# Altium schematic sheet SBH_Charger_Connectors.SchDoc: SBH_Charger_Connectors
size B; Date: 01/15/2023; Author: Electric Squad; Organization: ORGANIZATION; Address1: ADDRESS 1; Address2: ADDRESS 2; Address3: ADDRESS 3; Address4: ADDRESS 4; Revision: -; SheetNumber: 1; SheetTotal: 5; ENG_APP_DATE: --/--/--; DSN_APP_DATE: --/--/--; CHK_APP_DATE: --/--/--
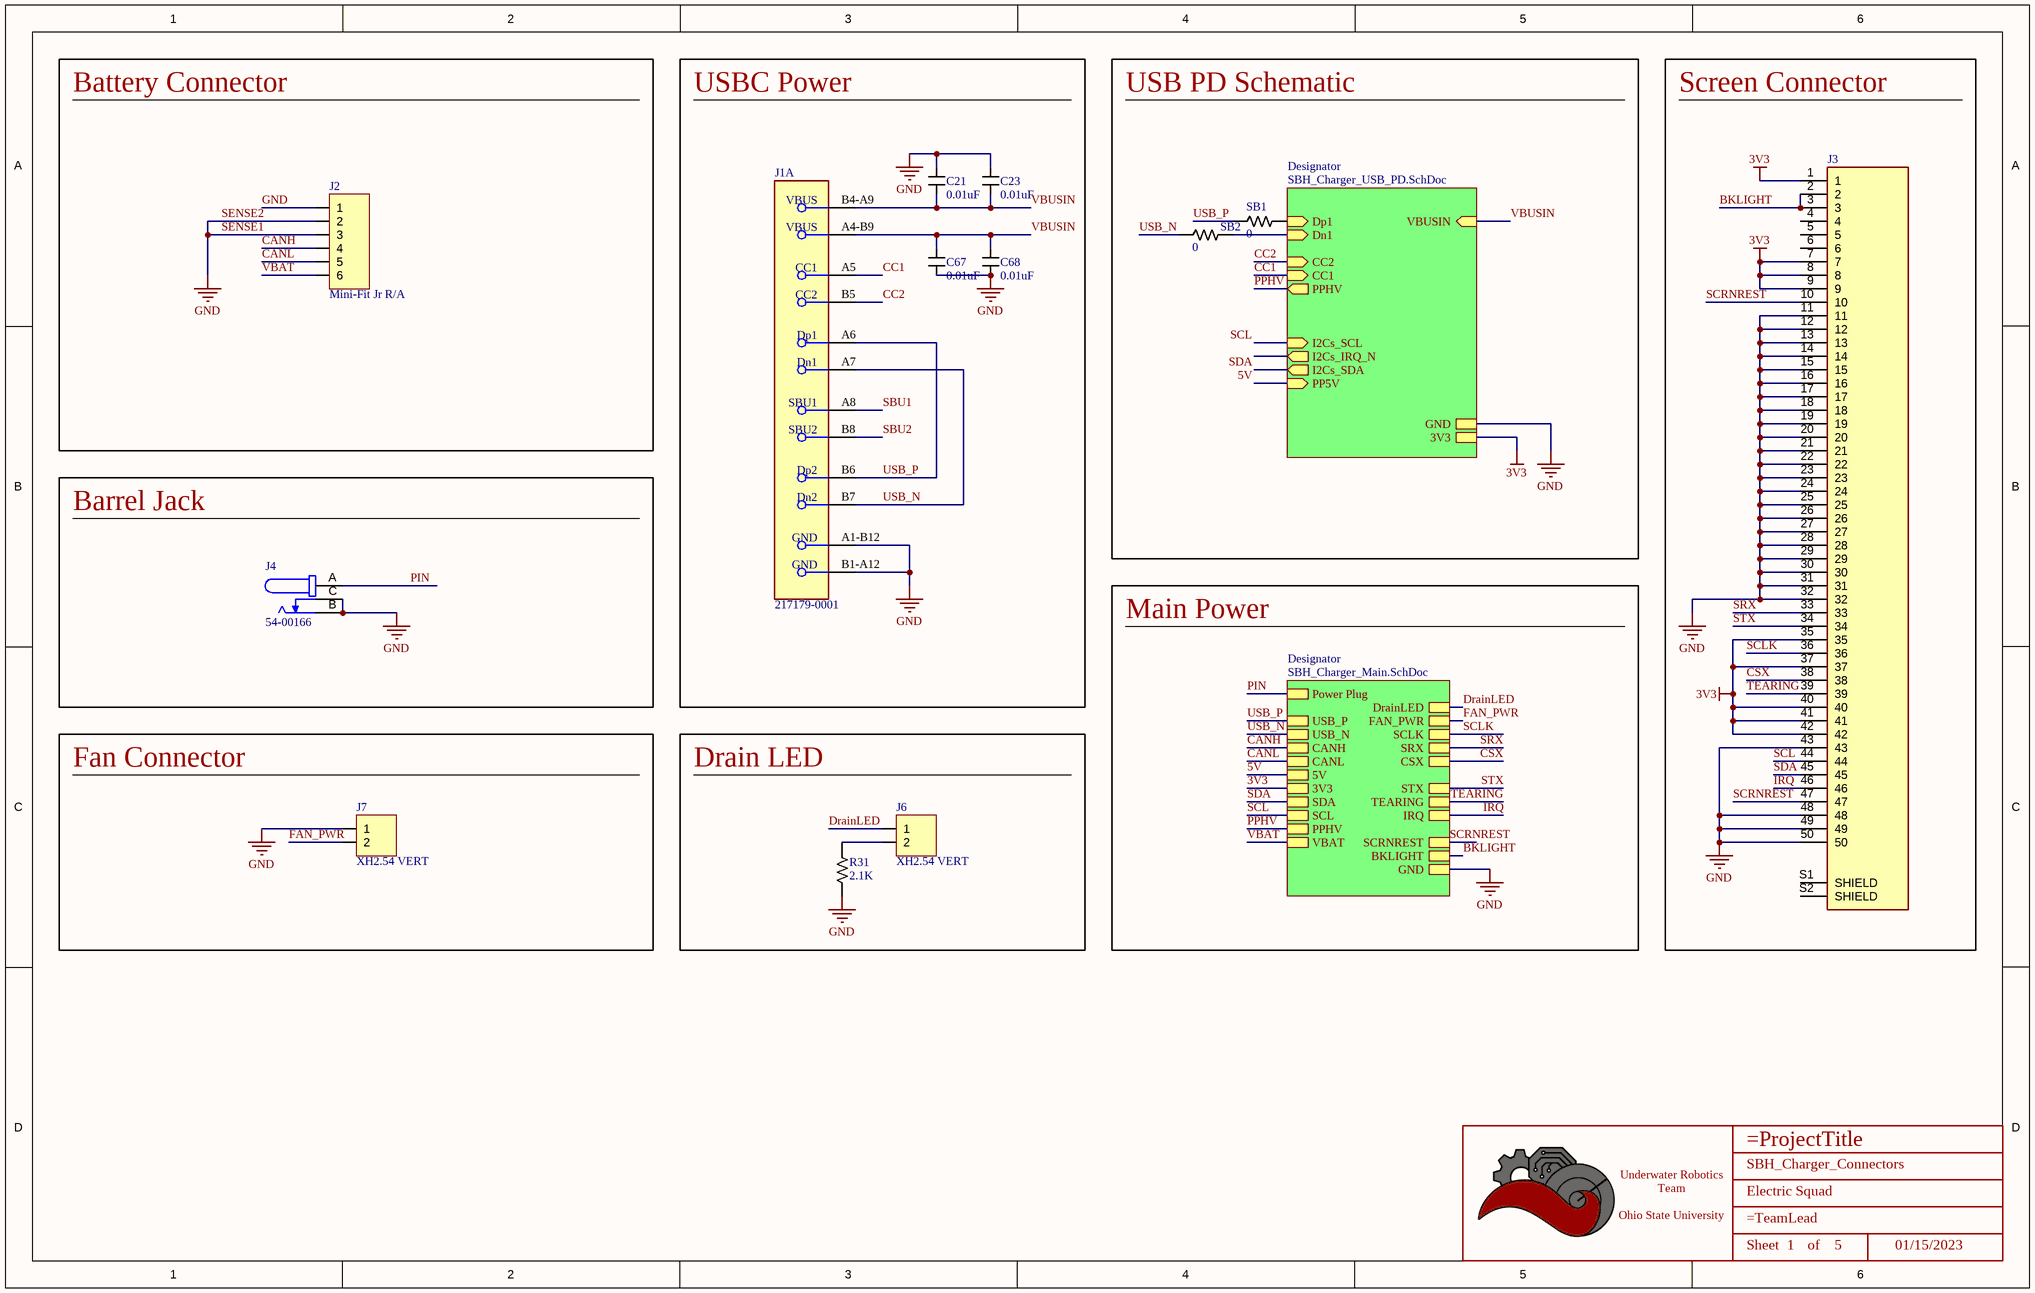
[diagram p0: SBH_Charger_Connectors.SchDoc]

## Parts
*  Title_Block  [LOGO]  (value not drawn)  (graphical)
C21  value 0.01uF  [CAPACITOR_0603]  (hidden comment: CL10B103KB8NNNC)
C23  value 0.01uF  [CAPACITOR_0603]  (hidden comment: CL10B103KB8NNNC)
C67  value 0.01uF  [CAPACITOR_0603]  (hidden comment: CL10B103KB8NNNC)
C68  value 0.01uF  [CAPACITOR_0603]  (hidden comment: CL10B103KB8NNNC)
J1  217179-0001  [CONN_USBC_FP-217179-0001-MFG]  (part A of 2)
J2  Mini-Fit Jr R/A  [CONN_MOLEX_MINIFIT JR_6 POS_R/A]
J3  FFC_50POS_0.5MM_HORIZ_TOP  [EASTRISING_ER-CON50HT-1]  (value not drawn)
J4  54-00166  [TENSILITY_54-00166]
J6  XH2.54 VERT  [CONN_JST_XH254_2POS_VERT]
J7  XH2.54 VERT  [CONN_JST_XH254_2POS_VERT]
R31  Value  (Ohms): 2.1K  [RESISTOR_0603]  (hidden comment: 2.1k Ohm 5% 1/8W)
SB1  Value  (Ohms): 0  [RESISTOR_0603]  (hidden comment: 0 Ohm Jumper No Fit)
SB2  Value  (Ohms): 0  [RESISTOR_0603]  (hidden comment: 0 Ohm Jumper No Fit)

## Blocks framed on the sheet
Battery Connector: J2
USBC Power: C21 C23 C67 C68 J1
USB PD Schematic: SB1 SB2
Barrel Jack: J4
Fan Connector: J7
Drain LED: J6 R31

## Sub-sheets
Designator = SBH_Charger_USB_PD.SchDoc: Dp1 (in), Dn1 (in), CC2 (in), CC1 (in), PPHV (out), I2Cs_SCL (in), I2Cs_IRQ_N (out), I2Cs_SDA (out), PP5V (in), GND, 3V3, VBUSIN (in)
Designator = SBH_Charger_Main.SchDoc: Power Plug, GND, USB_P, USB_N, CANH, CANL, 5V, 3V3, SDA, VBAT, PPHV, FAN_PWR, SCL, DrainLED, BKLIGHT, SCRNREST, SRX, CSX, STX, TEARING, IRQ, SCLK

## Nets
3V3: J3.1 J3.7 J3.8 J3.9 J3.35 J3.37 J3.40 J3.41 J3.42 ; sheet Designator/3V3, sheet Designator/3V3
GND: C21.1 C23.1 C67.2 C68.2 J1.A1-B12(GND) J1.B1-A12(GND) J2.1 J2.2 J2.3 J3.11 J3.12 J3.13 J3.14 J3.15 J3.16 J3.17 J3.18 J3.19 J3.20 J3.21 J3.22 J3.23 J3.24 J3.25 J3.26 J3.27 J3.28 J3.29 J3.30 J3.31 J3.32 J3.43 J3.48 J3.49 J3.50 J4.B J4.C J7.1 R31.2 ; sheet Designator/GND, sheet Designator/GND  [also labelled SENSE1, SENSE2]
5V: sheet Designator/PP5V, sheet Designator/5V
BKLIGHT: J3.2 J3.3 ; sheet Designator/BKLIGHT
CANH: J2.4 ; sheet Designator/CANH
CANL: J2.5 ; sheet Designator/CANL
CC1: J1.A5(CC1) ; sheet Designator/CC1
CC2: J1.B5(CC2) ; sheet Designator/CC2
CSX: J3.38 ; sheet Designator/CSX
DrainLED: J6.1 ; sheet Designator/DrainLED
FAN_PWR: J7.2 ; sheet Designator/FAN_PWR
IRQ: J3.46 ; sheet Designator/IRQ
PIN: J4.A ; sheet Designator/Power Plug
PPHV: sheet Designator/PPHV, sheet Designator/PPHV
SBU1: J1.A8(SBU1)
SBU2: J1.B8(SBU2)
SCL: J3.44 ; sheet Designator/I2Cs_SCL, sheet Designator/SCL
SCLK: J3.36 ; sheet Designator/SCLK
SCRNREST: J3.10 J3.47 ; sheet Designator/SCRNREST
SDA: J3.45 ; sheet Designator/I2Cs_SDA, sheet Designator/SDA
SRX: J3.33 ; sheet Designator/SRX
STX: J3.34 ; sheet Designator/STX
TEARING: J3.39 ; sheet Designator/TEARING
USB_N: J1.A7(Dn1) J1.B7(Dn2) SB2.2 ; sheet Designator/USB_N
USB_P: J1.A6(Dp1) J1.B6(Dp2) SB1.2 ; sheet Designator/USB_P
VBAT: J2.6 ; sheet Designator/VBAT
VBUSIN: C21.2 C23.2 C67.1 C68.1 J1.A4-B9(VBUS) J1.B4-A9(VBUS) ; sheet Designator/VBUSIN
NetJ6_2: J6.2 R31.1
NetSB1_1: SB1.1 ; sheet Designator/Dp1
NetSB2_1: SB2.1 ; sheet Designator/Dn1

Not connected (* = marked no-connect by the designer): J3 4 5 6 S1(SHIELD) S2(SHIELD)

## Notes on the sheet
- Screen Connector
- Main Power
- DWG. NO.
- REV.
- SHT.
- THIS DOCUMENT AND THE DATA DISCLOSED HEREIN OR HEREWITH IS THE PROPERTY OF ALTIUM LIMITED AND MAY BE FREELY DISTRIBUTED IN WHOLE. NO RIGHTS ARE RESERVED OR EXPRESS OR IMPLIED WARANTEE GIVEN.
- REVISION
- DESCRIPTION
- DATE
- APPROVED
- ENG:
- APPROVALS
- PROJECT
- DSN:
- CHK:
- REFERENCE DOCUMENTS
- PROJECT REVISION:
- TITLE
- DOCUMENT REVISION:
- DESIGN ITEM:
- BOM:
- FAB DWG:
- PCB DWG:
- ASSY DWG:
- SCALE:
- SIZE
- B
- CAGE CODE
- FILE NAME
- DWG NO.
- SHEET
- OF
- REV
- (in symbol Title_Block) Underwater Robotics Team / Ohio State University; Sheet; of

## Library data of the parts
* = Title_Block: UWRT Schematic Title Block Template / Created June 2021, Dylan Trainor
C21 C23 C67 C68 = CAPACITOR_0.01uF_0603_50V: 10000 pF ±10% 50V Ceramic Capacitor X7R 0603 (1608 Metric); Tolerance: +/- 10%; Voltage: 6.3V; Made By: Flip B; ComponentLink1Description: Datsheet; ComponentLink1URL: https://www.mouser.com/datasheet/2/212/KEM_C1002_X7R_SMD-1102033.pdf; Supplier 1: Arrow Electronics; Supplier Part Number 1: CL10B103KB8NNNC
J1 = CONN_USBC_CMP-04767-000028-1: CONN RCP USB2.0 TYP C 24P SMD RA; Created by: James Mills
J2 = CONN_MOLEX_MINIFIT JR_6POS_R/A: Molex Minifit Jr. 5569 / 6 Pos R/A Natural; Pitch: 4.2mm; Configuration: Right Angle; Current Per Pin: 13A; Number of Positions: 8; Manufacturer: Molex; Color: Natural; Created By: Flip B; ComponentLink1Description: Datasheet; ComponentLink1URL: https://www.molex.com/pdm_docs/ps/PS-5556-001.pdf; Series: Minifit Jr 5569; Supplier 1: Digi-Key; Supplier Part Number 1: WM1353-ND
J3 = FFC_50POS_0.5MM_HORIZ_TOP: 50 pins 0.5 Pitch SMD Horizontal Type Top Contact; Made By: Andrew Lin; FFC Type: ZIF Locking; Max Current: ?; Orientation: Horizontal Top; Pin Count: 50; Contact Plating: Phosphor Bronze, Tin/Lead Plated; Supplier 1: Digi-Key; Supplier Part Number 1: HFK116CT-ND
J4 = 54-00166: Connector, dc jack 5.5x2.1 mm, PCB mount, 90 degrees, nickel plated, PBT, thru hole; MF: Tensility International Corp; Package: None; Price: None; Check_prices: https://www.snapeda.com/parts/54-00166/Tensility+International+Corp/view-part/?ref=eda; Value: *; SnapEDA_Link: https://www.snapeda.com/parts/54-00166/Tensility+International+Corp/view-part/?ref=snap; MP: 54-00166; Availability: In Stock; Purchase-URL: https://pricing.snapeda.com/search?q=54-00166&ref=eda; Supplier 1: Digi-Key; Supplier Part Number 1: 839-54-00166-ND
J6 J7 = CONN_JST_XH254_2POS_VERT: JST XH 2.54mm Pitch 2 Pos Vertical; Current Per Pin: 4A; Number of Positions: 2; NOTE: Do not use JST 2.5mm parts with this footprint. JST does not make 2.54mm pitch pins, rather only clones make this connector!; Manufacturer: JST; Pitch: 2.54mm; Configuration: Vertical; Color: White; Created By: Robert P; Series: XH 2.54; ComponentLink1Description: Purchase Link; ComponentLink1URL: https://www.amazon.com/460PCS-XH2-54-Connector-Terminal-Connectors/dp/B09DBGVX5C
R31 = RESISTOR_2.1K_0603: RES 2.1k OHM 5% 1/8W 0603; Tolerance: +/- 5%; Made By: Robert Pafford; ComponentLink1Description: Datasheet; ComponentLink1URL: https://www.bourns.com/docs/product-datasheets/CRxxxxx.pdf; Wattage: 1/8W; Supplier: Digikey; Digikey Part Numer: CR0603-JW-104ELFTR-ND; Supplier 1: Digi-Key; Supplier Part Number 1: YAG1852CT-ND
SB1 SB2 = JUMPER_0_0603: 0 Ohm Jumper No Fit for Solder Bridge; Made By: Robert Pafford; ComponentLink1Description: Digikey; ComponentLink1URL: https://www.digikey.com/en/products/detail/koa-speer-electronics-inc/RK73B1JTTD101J/9844701